# EAGLE design Drifter (EAGLE 7.3.0)
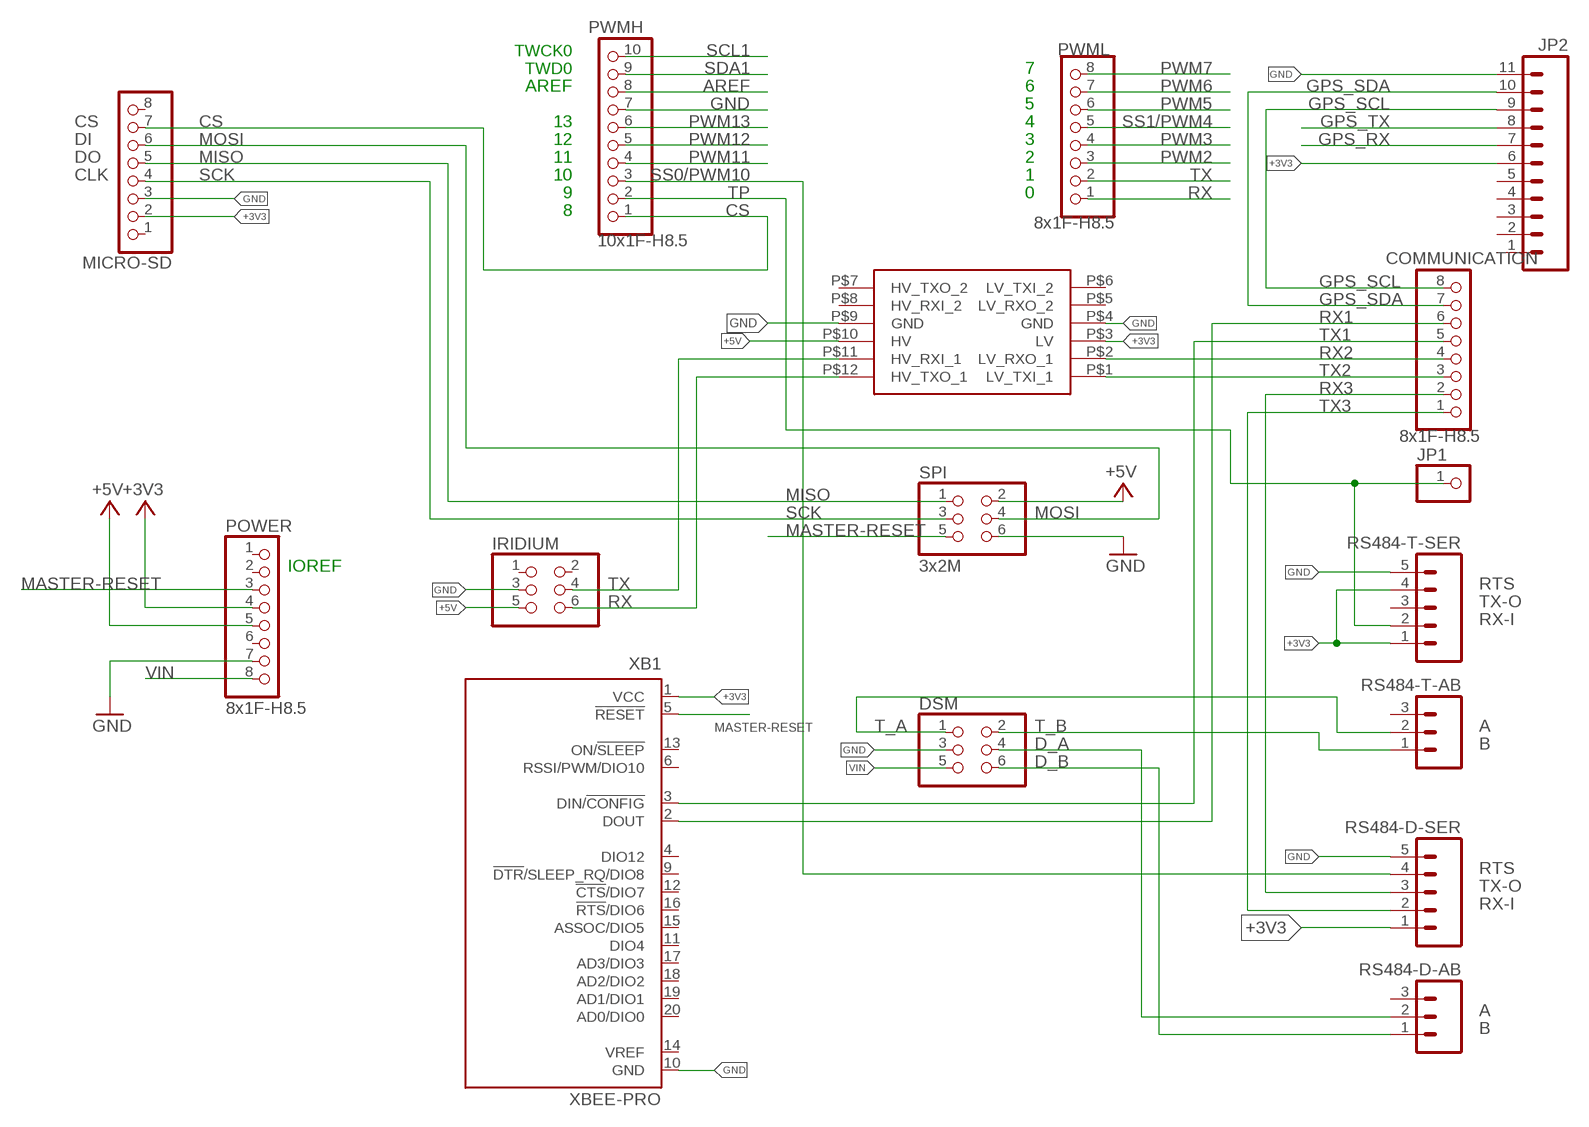
[diagram p0: schematic, sheet 1]

## Parts
COMMUNICATION  8x1F-H8.5  PINHD-1X8  [1X08]
DSM  PINHD-2X3  [2X03]
IRIDIUM  PINHD-2X3  [2X03]
JP1  PINHD-1X1  [1X01]
JP2  M111.27MM  [1X11-1.27MM]
MICRO-SD  PINHD-1X8BIG  [1X08-BIG]
POWER  8x1F-H8.5  PINHD-1X8  [1X08]
PWMH  10x1F-H8.5  PINHD-1X10  [1X10]
PWML  8x1F-H8.5  PINHD-1X8  [1X08]
RS484-D-AB  M03PTH  [1X03]
RS484-D-SER  M05PTH  [1X05]
RS484-T-AB  M03PTH  [1X03]
RS484-T-SER  M05PTH  [1X05]
SPI  3x2M  PINHD-2X3  [2X03]
U$1  LOGIC_LEVEL_CONVERTER  [LOGIC_LEVEL_CONVERTER]
XB1  XBEE-PRO  [XBEE-PRO]

## Nets
+3V3 [Power]: JP2.6 MICRO-SD.2 POWER.4 RS484-D-SER.1 RS484-T-SER.1 RS484-T-SER.4 U$1.P$3(LV) XB1.1(VCC)
+5V [Power]: IRIDIUM.5 POWER.5 SPI.2 U$1.P$10(HV)
AREF: PWMH.8
CS: MICRO-SD.7 PWMH.1
D_A [12V]: DSM.4 RS484-D-AB.2
D_B [12V]: DSM.6 RS484-D-AB.1
GND [Power]: DSM.3 IRIDIUM.3 JP2.11 MICRO-SD.3 POWER.7 PWMH.7 RS484-D-SER.5 RS484-T-SER.5 SPI.6 U$1.P$4(GND) U$1.P$9(GND) XB1.10(GND)
GPS_RX: JP2.7
GPS_SCL: COMMUNICATION.8 JP2.9
GPS_SDA: COMMUNICATION.7 JP2.10
GPS_TX: JP2.8
MASTER-RESET: POWER.3 SPI.5 XB1.5(!RESET)
MISO: MICRO-SD.5 SPI.1
MOSI: MICRO-SD.6 SPI.4
N$1: IRIDIUM.4 U$1.P$11(HV_RXI_1)
N$2: IRIDIUM.6 U$1.P$12(HV_TXO_1)
PWM2: PWML.3
PWM3: PWML.4
PWM5: PWML.6
PWM6: PWML.7
PWM7: PWML.8
PWM11: PWMH.4
PWM12: PWMH.5
PWM13: PWMH.6
RX: PWML.1
RX1: COMMUNICATION.6 XB1.2(DOUT)
RX2: COMMUNICATION.4 U$1.P$2(LV_RXO_1)
RX3: COMMUNICATION.2 RS484-D-SER.3
SCK: MICRO-SD.4 SPI.3
SCL1: PWMH.10
SDA1: PWMH.9
SS0/PWM10: PWMH.3 RS484-D-SER.4
SS1/PWM4: PWML.5
T_A [12V]: DSM.1 RS484-T-AB.2
T_B [12V]: DSM.2 RS484-T-AB.1
TP: JP1.1 PWMH.2 RS484-T-SER.2
TX: PWML.2
TX1: COMMUNICATION.5 XB1.3(DIN/!CONFIG)
TX2: COMMUNICATION.3 U$1.P$1(LV_TXI_1)
TX3: COMMUNICATION.1 RS484-D-SER.2
VIN [12V]: DSM.5 POWER.8
Unconnected: IRIDIUM.1 IRIDIUM.2 JP2.1 JP2.2 JP2.3 JP2.4 JP2.5 MICRO-SD.1 MICRO-SD.8 POWER.1 POWER.2 POWER.6 RS484-D-AB.3 RS484-T-AB.3 RS484-T-SER.3 U$1.P$5(LV_RXO_2) U$1.P$6(LV_TXI_2) U$1.P$7(HV_TXO_2) U$1.P$8(HV_RXI_2) XB1.4(DIO12) XB1.6(RSSI/PWM/DIO10) XB1.9(!DTR!/SLEEP_RQ/DIO8) XB1.11(DIO4) XB1.12(!CTS!/DIO7) XB1.13(ON/!SLEEP) XB1.14(VREF) XB1.15(ASSOC/DIO5) XB1.16(!RTS!/DIO6) XB1.17(AD3/DIO3) XB1.18(AD2/DIO2) XB1.19(AD1/DIO1) XB1.20(AD0/DIO0)

## Notes on the sheet
- TWCK0
- TWD0 | 7
- AREF | 6
- 5
- CS | 13 | 4
- DI | 12 | 3
- DO | 11 | 2
- CLK | 10 | 1
- 9 | 0
- 8
- IOREF
- TX | RTS
- RX | TX-O
- RX-I
- A
- B
- RTS
- TX-O
- RX-I
- A
- B

## Library data of the parts
COMMUNICATION POWER PWML = SmartPrj:PINHD-1X8: PIN HEADER
DSM IRIDIUM = pinhead:PINHD-2X3: PIN HEADER
JP1 = pinhead:PINHD-1X1: PIN HEADER
JP2 = SparkFun-Connectors:M11: Header 11 Standard 11-pin 0.1" header. Use with straight break away headers (SKU : PRT-00116), right angle break away headers (PRT-00553), swiss pins (PRT-00743), machine pins (PRT-00117), and female headers (PRT-00115).
MICRO-SD = adafruit:PINHD-1X8: PIN HEADER
PWMH = SmartPrj:PINHD-1X10: PIN HEADER
RS484-D-AB RS484-T-AB = SparkFun-Connectors:M03: Header 3 Standard 3-pin 0.1" header. Use with straight break away headers (SKU : PRT-00116), right angle break away headers (PRT-00553), swiss pins (PRT-00743), machine pins (PRT-00117), and female headers (PRT-00115). Molex polarized connector foot print use with SKU : PRT-08232 with associated crimp pins and housings.
RS484-D-SER RS484-T-SER = SparkFun-Connectors:M05: Header 5 Standard 5-pin 0.1" header. Use with straight break away headers (SKU : PRT-00116), right angle break away headers (PRT-00553), swiss pins (PRT-00743), machine pins (PRT-00117), and female headers (PRT-00115). Molex polarized connector foot print use with SKU : PRT-08230 with associated crimp pins and housings.
SPI = SmartPrj:PINHD-2X3: PIN HEADER
U$1 = SparkFun-Boards:LOGIC_LEVEL_CONVERTER: Logic Level Converter (3.3v - 5v) https://www.sparkfun.com/products/8745
XB1 = xbee:XBEE: XBee (TM) /XBee-PRO(TM) OEM RF Modules Source: MaxStream, Inc. xbee_productmanual.pdf; MPN: XBP24-AWI-001; OC_FARNELL: 1337916; OC_NEWARK: 42M2667

## Net classes
0 default: width 0.203 mm, drill 0.406 mm, clearance 0.203 mm
1 USB: width 0.203 mm, drill 0.406 mm, clearance 0.203 mm
3 usbvcc: width 0.203 mm, drill 0.406 mm, clearance 0.203 mm
4 USBpair: width 0.254 mm, drill 0.406 mm, clearance 0.61 mm
5 12V: width 0.61 mm, drill 0.406 mm, clearance 0.61 mm
6 Power: width 0.381 mm, drill 0.406 mm, clearance 0.381 mm

## Board
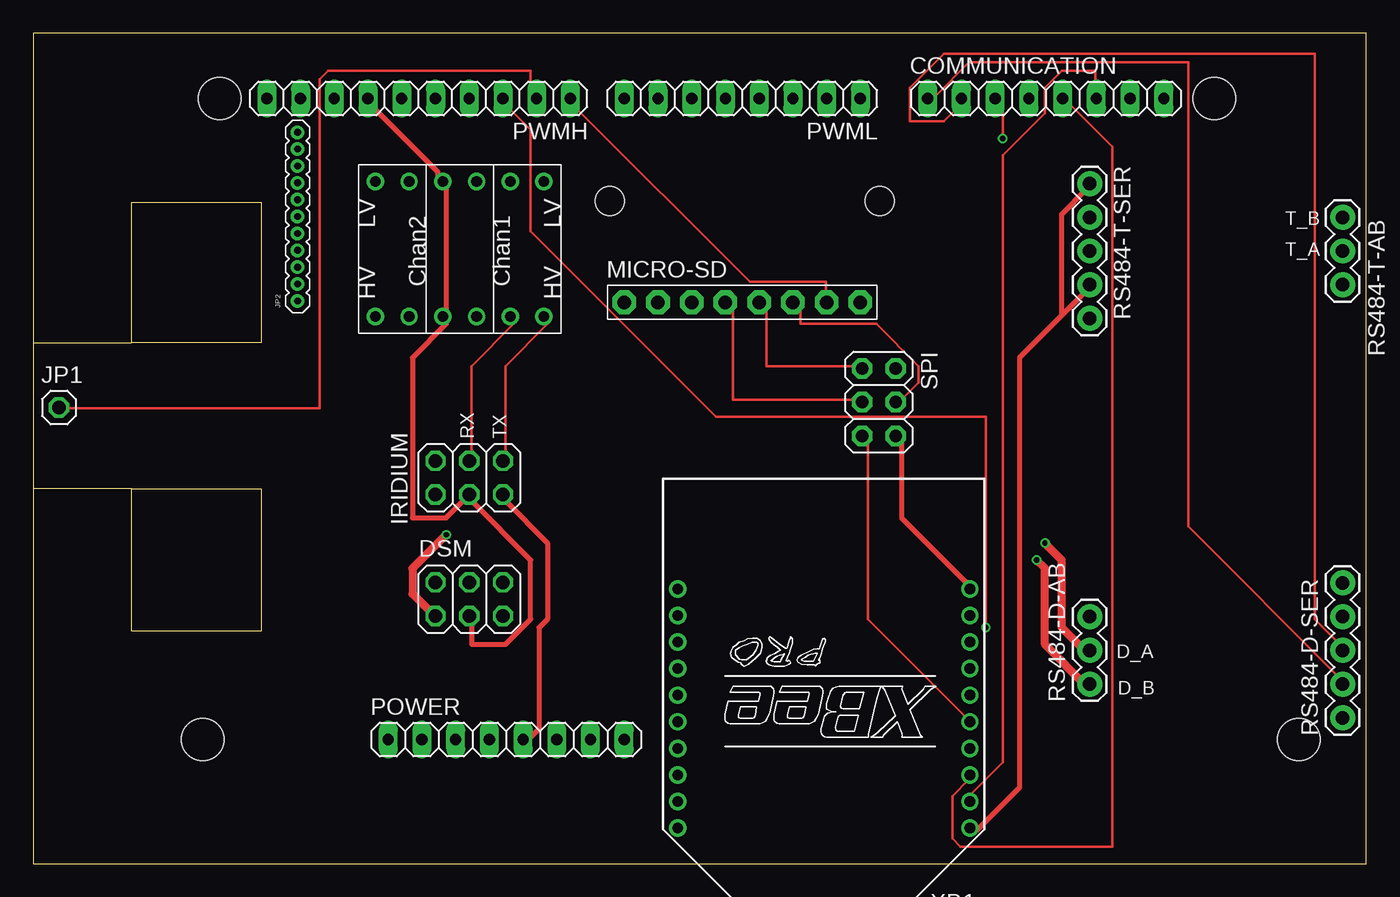
[diagram p1: board, top side]
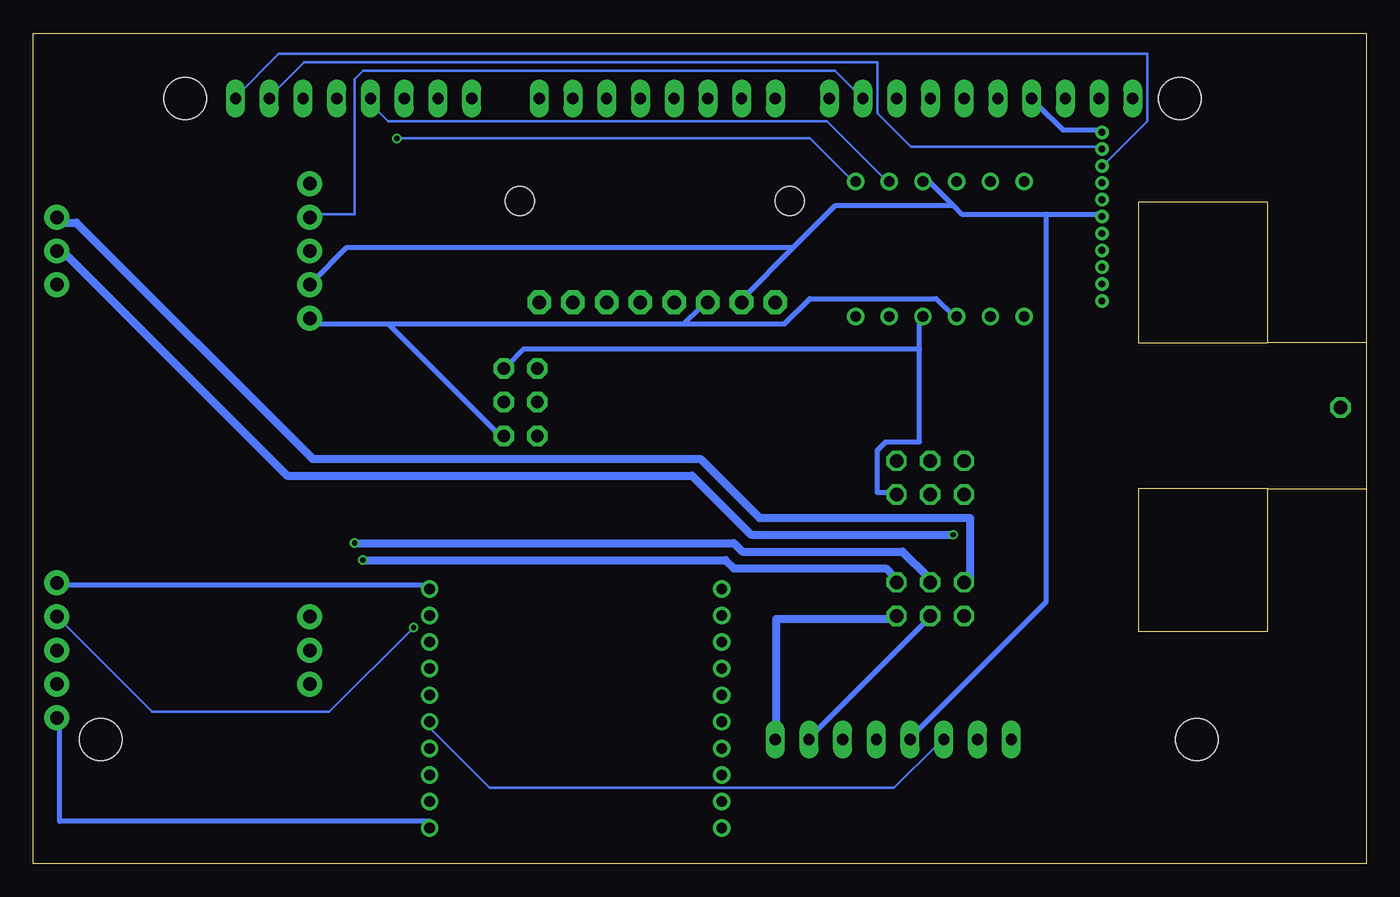
[diagram p2: board, bottom side, seen from below]

Size 100.41 x 62.52 mm. Coordinates in mm from the lower left corner, seen from the top.
Outline: 0,39.22 0,62.52 100.41,62.52 100.41,0 0,0 0,28.25
Outline: 0,39.22 7.43,39.22
Outline: 7.43,39.22 7.43,49.78 17.19,49.78 17.19,39.22 7.43,39.22
Outline: 0,39.22 0,28.25
Outline: 7.43,28.25 17.19,28.25 17.19,17.49 7.43,17.49 7.43,28.25
Outline: 7.43,28.25 0,28.25
Copper layers (1*16): Top 0.035mm / dielectric 1.5mm / Bottom 0.035mm
Design rules "Elecrow_2-layer_eagle_rule": minimum track width 6mil, minimum drill 12mil, track to track 6mil, track to pad 6mil, pad to pad 6mil, via to via 6mil, smd to smd 0mil, copper to edge 10mil, drill to drill 10mil, minimum pad ring 10mil, minimum via ring 6mil, stop-mask expansion 2mil, vias tented up to drill 100mil, thermal gap 10mil
Holes 3.2 mm at 14.04,57.61 88.97,57.61 95.32,9.35 12.77,9.35
Holes 2.2 mm at 63.74,49.89 43.42,49.89

### Footprints (pad centres in the part's own frame; a part is rotated, then mirrored left to right if it is on the bottom)
1X08 = drill 0.85 pad 1.422 long: 1 -8.89,0; 2 -6.35,0; 3 -3.81,0; 4 -1.27,0; 5 1.27,0; 6 3.81,0; 7 6.35,0; 8 8.89,0
2X03 = drill 1.016 octagon: 1 -2.54,-1.27; 2 -2.54,1.27; 3 0,-1.27; 4 0,1.27; 5 2.54,-1.27; 6 2.54,1.27
1X01 = drill 1.016 octagon: 1 0,0
1X11-1.27MM = drill 0.508 pad 1: 1 0,0; 2 1.27,0; 3 2.54,0; 4 3.81,0; 5 5.08,0; 6 6.35,0; 7 7.62,0; 8 8.89,0; 9 10.16,0; 10 11.43,0; 11 12.7,0
1X08-BIG = drill 1.016 pad 1.778 octagon: 1 -8.89,0; 2 -6.35,0; 3 -3.81,0; 4 -1.27,0; 5 1.27,0; 6 3.81,0; 7 6.35,0; 8 8.89,0
1X10 = drill 0.85 pad 1.422 long: 1 -11.43,0; 2 -8.89,0; 3 -6.35,0; 4 -3.81,0; 5 -1.27,0; 6 1.27,0; 7 3.81,0; 8 6.35,0; 9 8.89,0; 10 11.43,0
1X03 = drill 1.016 pad 1.88: 1 0,0; 2 2.54,0; 3 5.08,0
1X05 = drill 1.016 pad 1.88: 1 0,0; 2 2.54,0; 3 5.08,0; 4 7.62,0; 5 10.16,0
2X03' = drill 0.95 pad 1.55 octagon: 1 -2.54,-1.27; 2 -2.54,1.27; 3 0,-1.27; 4 0,1.27; 5 2.54,-1.27; 6 2.54,1.27
LOGIC_LEVEL_CONVERTER = drill 0.8: P$1 1.27,13.97; P$2 1.27,11.43; P$3 1.27,8.89; P$4 1.27,6.35; P$5 1.27,3.81; P$6 1.27,1.27; P$7 11.43,1.27; P$8 11.43,3.81; P$9 11.43,6.35; P$10 11.43,8.89; P$11 11.43,11.43; P$12 11.43,13.97
XBEE-PRO = drill 0.8 pad 1.27: 1 -11,9; 2 -11,7; 3 -11,5; 4 -11,3; 5 -11,1; 6 -11,-1; 7 -11,-3; 8 -11,-5; 9 -11,-7; 10 -11,-9; 11 11,-9; 12 11,-7; 13 11,-5; 14 11,-3; 15 11,-1; 16 11,1; 17 11,3; 18 11,5; 19 11,7; 20 11,9

### Placement (x,y rotation side)
COMMUNICATION  76.27,57.61 0 top
DSM  32.84,19.91 0 top
IRIDIUM  32.84,29.06 0 top
JP1  1.95,34.34 0 top
JP2  19.91,42.37 90 top
MICRO-SD  53.41,42.27 0 top
POWER  35.63,9.35 0 top
PWMH  29.02,57.61 180 top
PWML  53.41,57.61 180 top
RS484-D-AB  79.57,13.52 90 top
RS484-D-SER  98.62,10.98 90 top
RS484-T-AB  98.62,48.67 270 top
RS484-T-SER  79.57,51.21 270 top
SPI  3x2M  [2X03']  63.69,34.75 270 top
U$1  24.5,52.63 270 top
XB1  59.55,11.68 180 top

### Tracks (layer width: path | path; a pad name or v marks a point on that pad's centre or on a via)
+3V3
  Top 0.381: 77.47,41.27 79.38,43.18 RS484-T-SER.4 | 77.47,41.27 74.3,38.1 74.3,5.71 71.12,2.54 XB1.1 | 77.47,41.27 77.47,48.9 79.38,50.8 RS484-T-SER.1
  Bottom 0.381: 24.13,48.9 30.48,48.9 31.11,49.53 | 24.13,48.9 20.32,48.9 JP2.6 | 31.11,49.53 33.02,51.44 U$1.P$3 | 24.13,48.9 24.13,19.68 34.29,9.53 POWER.4 | 43.18,46.35 40.01,49.53 31.11,49.53 | 43.18,46.35 46.99,42.55 MICRO-SD.2 | 43.18,46.35 76.83,46.35 79.38,43.81 RS484-T-SER.4 | RS484-D-SER.1 98.42,10.79 98.42,3.17 70.48,3.17 XB1.1
+5V
  Top 0.381: POWER.5 37.47,9.53 38.1,10.16 38.1,17.78 38.73,18.41 38.73,24.13 35.56,27.3 IRIDIUM.5
  Bottom 0.381: 33.66,38.73 33.66,31.75 36.2,31.75 36.83,31.11 36.83,27.94 35.56,27.94 IRIDIUM.5 | 33.66,38.73 33.66,40.64 U$1.P$10 | 33.66,38.73 63.5,38.73 64.77,37.47 SPI.2
CS
  Top 0.203: PWMH.1 40.64,57.15 53.98,43.81 59.69,43.81 59.69,42.55 MICRO-SD.7
D_A  (via drill 0.41)
  Top 0.61: v76.2,24.13 77.47,22.86 77.47,17.78 79.38,15.88 RS484-D-AB.2
  Bottom 0.61: v76.2,24.13 47.62,24.13 46.99,23.5 34.92,23.5 33.02,21.59 DSM.4
D_B  (via drill 0.41)
  Top 0.61: v75.56,22.86 76.2,22.23 76.2,16.51 79.38,13.34 RS484-D-AB.1
  Bottom 0.61: v75.56,22.86 48.26,22.86 47.62,22.23 36.2,22.23 35.56,21.59 DSM.6
GND
  Top 0.381: XB1.10 70.48,20.95 65.41,26.04 65.41,31.75 SPI.6 | DSM.3 33.02,18.41 33.02,16.51 35.56,16.51 37.47,18.41 37.47,22.86 33.02,27.3 IRIDIUM.3 32.38,27.3 31.11,26.04 28.57,26.04 28.57,38.1 31.11,40.64 U$1.P$9 31.11,41.27 31.11,50.8 U$1.P$4 30.48,51.44 30.48,52.07 25.4,57.15 PWMH.7
  Bottom 0.381: RS484-D-SER.5 98.42,20.95 71.12,20.95 XB1.10 | POWER.7 41.91,9.53 33.02,18.41 DSM.3 | JP2.11 20.32,55.24 22.86,55.24 24.77,57.15 PWMH.7 | 51.44,40.64 50.16,41.91 MICRO-SD.3 | 73.66,40.64 79.38,40.64 RS484-T-SER.5 | 73.66,40.64 51.44,40.64 | 51.44,40.64 43.81,40.64 41.91,42.55 32.38,42.55 31.11,41.27 U$1.P$9 | 73.66,40.64 65.41,32.38 SPI.6
GPS_SCL
  Bottom 0.203: JP2.9 19.68,52.7 16.51,55.88 16.51,60.96 81.92,60.96 85.09,57.78 COMMUNICATION.8
GPS_SDA
  Bottom 0.203: JP2.10 20.32,53.98 34.29,53.98 36.83,56.52 36.83,60.33 80.01,60.33 82.55,57.78 COMMUNICATION.7
MASTER-RESET
  Top 0.203: XB1.5 70.48,10.79 62.87,18.41 62.87,31.75 SPI.5
  Bottom 0.203: POWER.3 32.38,8.89 35.56,5.71 66.04,5.71 70.48,10.16 XB1.5
MISO
  Top 0.203: SPI.1 62.23,37.47 55.24,37.47 55.24,41.91 MICRO-SD.5
MOSI
  Top 0.203: SPI.4 65.41,34.92 66.67,36.2 66.67,37.47 63.5,40.64 57.78,40.64 57.78,41.91 MICRO-SD.6
N$1
  Top 0.203: U$1.P$11 36.2,40.64 33.02,37.47 33.02,30.48 IRIDIUM.4
N$2
  Top 0.203: U$1.P$12 38.73,40.64 35.56,37.47 35.56,30.48 IRIDIUM.6
RX1
  Top 0.203: XB1.2 70.48,5.08 73.03,7.62 73.03,53.34 76.2,56.52 76.2,58.42 77.47,59.69 80.01,59.69 80.01,57.78 COMMUNICATION.6
RX2
  Bottom 0.203: U$1.P$2 36.2,51.44 40.64,55.88 73.66,55.88 74.93,57.15 COMMUNICATION.4
RX3
  Top 0.203: COMMUNICATION.2 69.85,57.15 68.58,55.88 66.04,55.88 66.04,58.42 68.58,60.96 96.52,60.96 96.52,18.41 98.42,16.51 RS484-D-SER.3
SCK
  Top 0.203: SPI.3 62.23,34.92 52.7,34.92 52.7,41.91 MICRO-SD.4
SS0/PWM10  (via drill 0.41)
  Top 0.203: v71.75,17.78 71.75,33.66 51.44,33.66 37.47,47.62 37.47,55.24 35.56,57.15 PWMH.3
  Bottom 0.203: v71.75,17.78 78.11,11.43 91.44,11.43 98.42,18.41 RS484-D-SER.4
T_A  (via drill 0.41)
  Top 0.61: v31.11,24.77 28.57,22.23 28.57,20.32 29.84,19.05 DSM.1
  Bottom 0.61: v31.11,24.77 46.35,24.77 50.8,29.21 81.28,29.21 97.79,45.72 98.42,45.72 RS484-T-AB.2
T_B
  Bottom 0.61: DSM.2 29.84,21.59 29.84,26.04 45.72,26.04 50.16,30.48 79.38,30.48 97.16,48.26 98.42,48.26 RS484-T-AB.1
TP
  Top 0.203: JP1.1 2.54,34.29 21.59,34.29 21.59,59.05 22.23,59.69 37.47,59.69 37.47,57.78 PWMH.2
  Bottom 0.203: PWMH.2 38.1,57.78 40.01,59.69 75.56,59.69 76.2,59.05 76.2,48.9 79.38,48.9 RS484-T-SER.2
TX1
  Top 0.203: XB1.3 70.48,6.35 69.22,5.08 69.22,1.91 69.85,1.27 81.28,1.27 81.28,53.98 78.11,57.15 COMMUNICATION.5
TX2  (via drill 0.41)
  Top 0.203: v73.03,54.61 73.03,57.15 COMMUNICATION.3
  Bottom 0.203: v73.03,54.61 41.91,54.61 38.73,51.44 U$1.P$1
TX3
  Top 0.203: COMMUNICATION.1 67.94,57.78 70.48,60.33 87,60.33 87,25.4 98.42,13.97 RS484-D-SER.2
VIN
  Bottom 0.61: POWER.8 44.45,9.53 44.45,18.41 35.56,18.41 DSM.5

### Text on the board
tNames: T_B | T_A | RX | TX | D_A | D_B